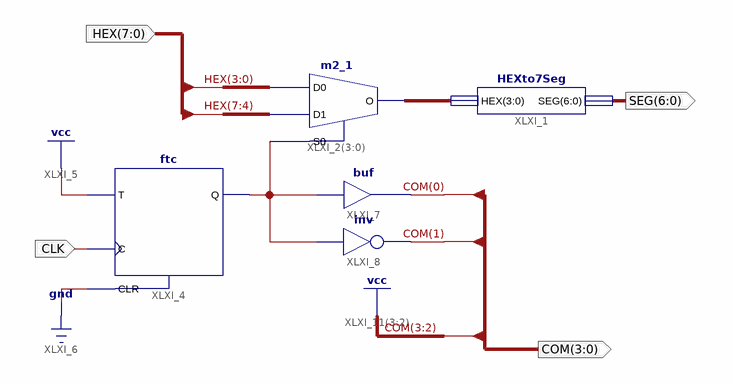
[diagram p0: schematic sheet 1]
// Xilinx ISE schematic HEXto7Seg2Digit.sch (spartan6) as structural Verilog: 5 symbols, 4 ports
module HEXto7Seg2Digit (
  input  [7:0] HEX,
  input  CLK,
  output [6:0] SEG,
  output [3:0] COM
);

  wire XLXN_6;
  wire [3:0] XLXN_1;

  HEXto7Seg XLXI_1 (.HEX(XLXN_1), .SEG(SEG));
  m2_1 XLXI_2[3:0] (.D0(HEX[3:0]), .D1(HEX[7:4]), .S0(XLXN_6), .O(XLXN_1));
  ftc XLXI_4 (.C(CLK), .CLR(1'b0), .T(1'b1), .Q(XLXN_6));
  buf XLXI_7 (COM[0], XLXN_6);
  not XLXI_8 (COM[1], XLXN_6);

  assign COM[3:2] = 2'b11;
endmodule
